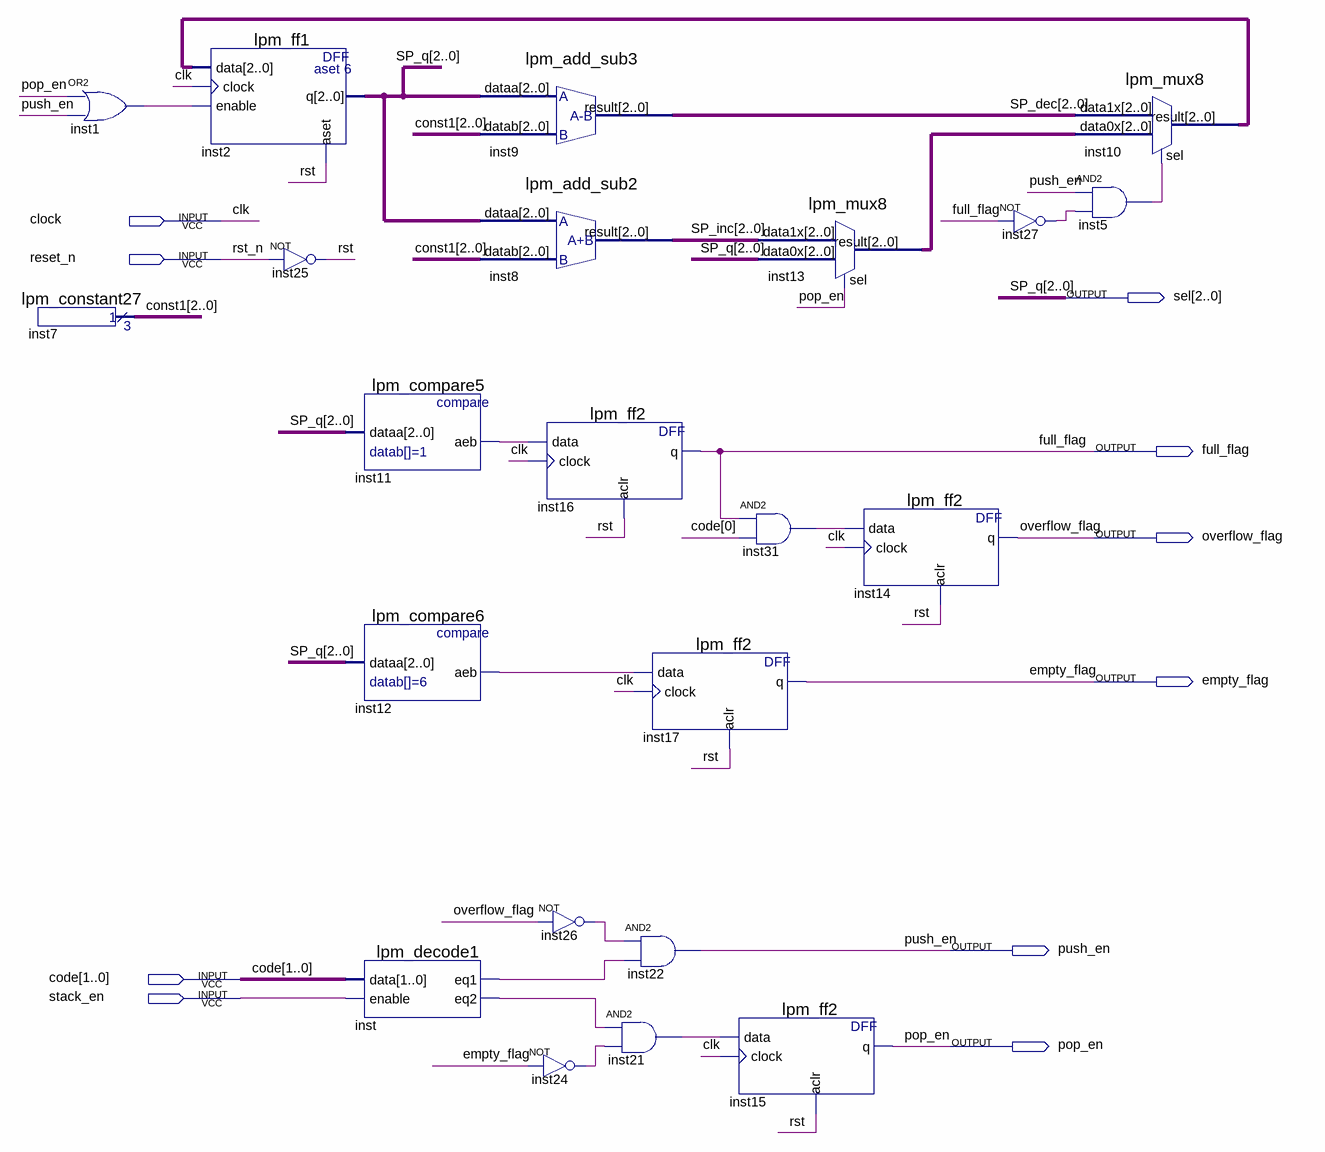
[diagram p0: schematic sheet]
// Quartus schematic stack_controller_unit.bdf as structural Verilog: 22 symbols, 10 pins
module stack_controller_unit (
  input  clock,
  input  reset_n,
  input  [1:0] code,
  input  stack_en,
  output [2:0] sel,
  output full_flag,
  output overflow_flag,
  output empty_flag,
  output push_en,
  output pop_en
);

  wire inst1_out, inst5_out, inst11_aeb, inst12_aeb, inst21_out, inst24_out, inst26_out, inst27_out,
       inst31_out, inst_eq1, inst_eq2, rst;
  wire [2:0] const1, inst10_result, inst13_result, SP_dec, SP_inc;

  or inst1 (inst1_out, pop_en, push_en);
  lpm_constant27 inst7 (.result(const1));
  lpm_ff1 inst2 (.data(inst10_result), .clock(clock), .enable(inst1_out), .aset(rst), .q(sel));
  not inst25 (rst, reset_n);
  lpm_compare5 inst11 (.dataa(sel), .aeb(inst11_aeb));
  lpm_compare6 inst12 (.dataa(sel), .aeb(inst12_aeb));
  lpm_decode1 inst (.data(code), .enable(stack_en), .eq1(inst_eq1), .eq2(inst_eq2));
  lpm_add_sub3 inst9 (.dataa(sel), .datab(const1), .result(SP_dec));
  lpm_add_sub2 inst8 (.dataa(sel), .datab(const1), .result(SP_inc));
  lpm_ff2 inst16 (.data(inst11_aeb), .clock(clock), .aclr(rst), .q(full_flag));
  not inst26 (inst26_out, overflow_flag);
  not inst24 (inst24_out, empty_flag);
  and inst22 (push_en, inst26_out, inst_eq1);
  and inst21 (inst21_out, inst_eq2, inst24_out);
  lpm_ff2 inst17 (.data(inst12_aeb), .clock(clock), .aclr(rst), .q(empty_flag));
  lpm_mux8 inst13 (.data1x(SP_inc), .data0x(sel), .sel(pop_en), .result(inst13_result));
  and inst31 (inst31_out, full_flag, code[0]);
  lpm_ff2 inst15 (.data(inst21_out), .clock(clock), .aclr(rst), .q(pop_en));
  lpm_ff2 inst14 (.data(inst31_out), .clock(clock), .aclr(rst), .q(overflow_flag));
  not inst27 (inst27_out, full_flag);
  lpm_mux8 inst10 (.data1x(SP_dec), .data0x(inst13_result), .sel(inst5_out), .result(inst10_result));
  and inst5 (inst5_out, push_en, inst27_out);

  // Other names for the same wires on the sheet: clk = clock; rst_n = reset_n; SP_q[2:0] = sel
endmodule
